# Altium schematic sheet ФЭУ.SchDoc: =GlobalProjectName
size 410 x 297 mm; ApprovedBy: Утвердил; CheckedBy: Проверил; Author: Разработал; DocumentNumber: XXX.XX.XX.XX.XXX Э3; SheetNumber: 2; SheetTotal: 2; PageSetup: Record=PageOptions|CenterHorizontal=True|CenterVertical=True|PrintScale=1.00|XCorrection=1.00|YCorrection=1.00|PrintKind=1|BorderSize=5000000|LeftOffset=0|BottomOffset=0|Orientation=2|PaperLength=1000|PaperWidth=1000|Scale=100|PaperSource=15|PrintQuality=1200|MediaType=1|DitherType=10|PaperKind=A3|PrintScaleMode=1; Weight: -; ScaleFactor: -; NormInspection: Норм.Контр.; FirstApplication: XXX.XX.XX.XX.XXX; GlobalProjectNumber: XXX.XX.XX.XX.XXX
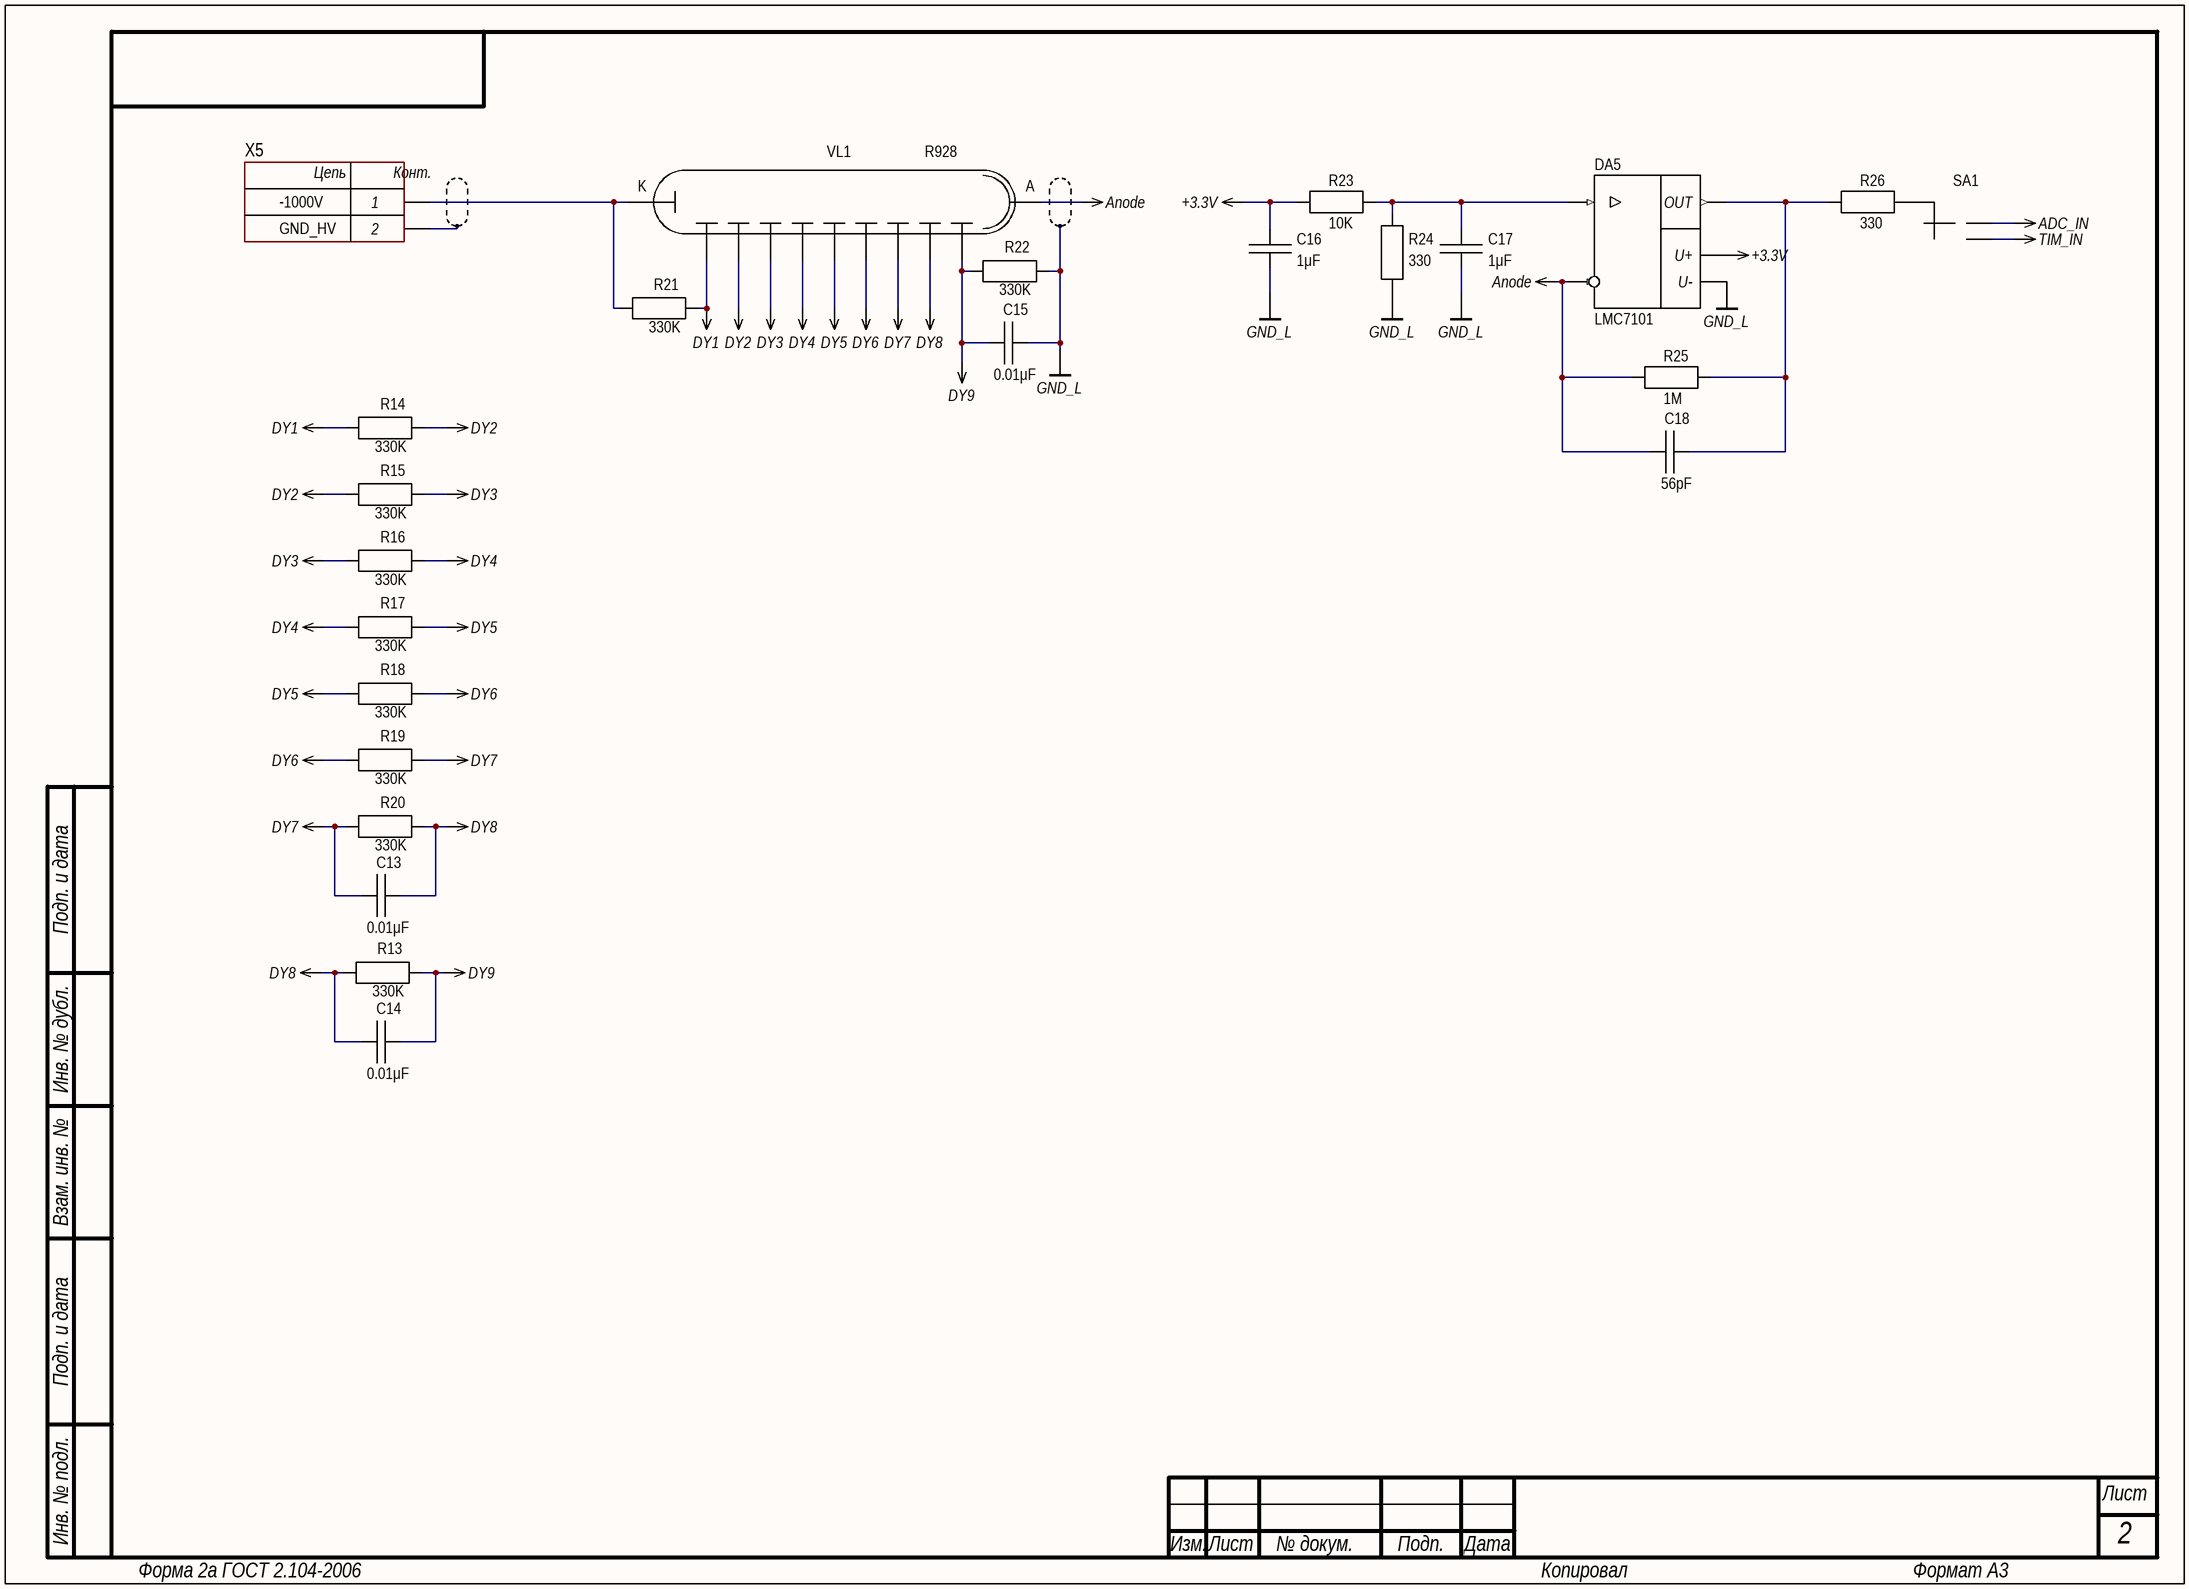
[diagram p0: ФЭУ.SchDoc]

## Parts
C13  value 0.01μF  [CAPASITOR 1206]
C14  value 0.01μF  [CAPASITOR 1206]
C15  value 0.01μF  [CAPASITOR 1206]
C16  value 1μF  [CAPASITOR 1206]
C17  value 1μF  [CAPASITOR 1206]
C18  value 56pF  [CAPASITOR 1206]
DA5  Операционный усилитель  (value not drawn)
R13  value 330K  [RESISTOR 1206]
R14  value 330K  [RESISTOR 1206]
R15  value 330K  [RESISTOR 1206]
R16  value 330K  [RESISTOR 1206]
R17  value 330K  [RESISTOR 1206]
R18  value 330K  [RESISTOR 1206]
R19  value 330K  [RESISTOR 1206]
R20  value 330K  [RESISTOR 1206]
R21  value 330K  [RESISTOR 1206]
R22  value 330K  [RESISTOR 1206]
R23  value 10K  [RESISTOR 1206]
R24  value 330  [RESISTOR 1206]
R25  value 1M  [RESISTOR 1206]
R26  value 330  [RESISTOR 1206]
SA1  Двухпозиционный переключатель  (value not drawn)
VL1  ФЭУ  (value not drawn)
X5  (no value)  [CON: 6PCV-03-006]

## Nets
+3.3V: C16.1 DA5.4(U+) R23.1
ADC_IN: SA1.1
Anode: C18.1 DA5.3 R25.2 VL1.11
DY1: R14.2 R21.1 VL1.2
DY2: R14.1 R15.2 VL1.3
DY3: R15.1 R16.2 VL1.4
DY4: R16.1 R17.2 VL1.5
DY5: R17.1 R18.2 VL1.6
DY6: R18.1 R19.2 VL1.7
DY7: C13.2 R19.1 R20.2 VL1.8
DY8: C13.1 C14.2 R13.2 R20.1 VL1.9
DY9: C14.1 C15.2 R13.1 R22.2 VL1.10
GND_L: C15.1 C16.2 C17.2 DA5.5(U-) R22.1 R24.2
TIM_IN: SA1.2
NetC17_1: C17.1 DA5.2 R23.2 R24.1
NetC18_2: C18.2 DA5.1(OUT) R25.1 R26.2
NetR21_2: R21.2 VL1.1 X5.1
NetR26_1: R26.1 SA1.A

Not connected (* = marked no-connect by the designer): X5 2

## Notes on the sheet
- (near VL1) R928
- -1000V
- GND_HV
- (near DA5) LMC7101
- Подп. и дата
- Инв. № дубл.
- Взам. инв. №
- Инв. № подл.
- Изм.
- Лист
- № докум.
- Подп.
- Дата
- Форма 2а ГОСТ 2.104-2006
- Копировал
- Формат А3
- (in symbol CONNECTOR 2 PIN) Цепь; Конт.
- (in symbol ФЭУ) K; A

## Library data of the parts
C13-C15 = CAPASITOR: Manufacturer: Yageo; PartNumber: CC1206KRX7R9BB104; ValueManufacturerPartNumber: Ceramic capacitor, 0.01μF, X7R, ±10%, 25V, 1206, -55...+125°C; TypeCapacitor: Ceramic capacitor; Tolerance: ±10%; TypeDielectric: X7R; Voltage: 25V; Package: 1206; HelpURL: https://www.digikey.com/product-detail/en/yageo/CC1206KRX7R9BB104/311-1179-1-ND/303089; Temperature: -55...+125°C
C16 C17 = CAPASITOR: Manufacturer: Yageo; PartNumber: CC1206KRX7R9BB104; ValueManufacturerPartNumber: Ceramic capacitor, 1μF, X7R, ±10%, 25V, 1206, -55...+125°C; TypeCapacitor: Ceramic capacitor; Tolerance: ±10%; TypeDielectric: X7R; Voltage: 25V; Package: 1206; HelpURL: https://www.digikey.com/product-detail/en/yageo/CC1206KRX7R9BB104/311-1179-1-ND/303089; Temperature: -55...+125°C
C18 = CAPASITOR: Manufacturer: Yageo; PartNumber: CC1206KRX7R9BB104; ValueManufacturerPartNumber: Ceramic capacitor, 56pF, X7R, ±10%, 25V, 1206, -55...+125°C; TypeCapacitor: Ceramic capacitor; Tolerance: ±10%; TypeDielectric: X7R; Voltage: 25V; Package: 1206; HelpURL: https://www.digikey.com/product-detail/en/yageo/CC1206KRX7R9BB104/311-1179-1-ND/303089; Temperature: -55...+125°C
R13-R22 = RESISTOR: Manufacturer: Yageo; PartNumber: RC1206JR-07100RL; ValueManufacturerPartNumber: Resistor film, 330K, ±5%, 1206, 0.25W, -55...+125°C; TypeResistor: Resistor film; Power: 0.25W; Tolerance: ±5%; Package: 1206; HelpURL: https://www.digikey.com/product-detail/en/yageo/RC1206JR-07100RL/311-100ERCT-ND/732153; Temperature: -55...+125°C
R23 = RESISTOR: Manufacturer: Yageo; PartNumber: RC1206JR-07100RL; ValueManufacturerPartNumber: Resistor film, 10K, ±5%, 1206, 0.25W, -55...+125°C; TypeResistor: Resistor film; Power: 0.25W; Tolerance: ±5%; Package: 1206; HelpURL: https://www.digikey.com/product-detail/en/yageo/RC1206JR-07100RL/311-100ERCT-ND/732153; Temperature: -55...+125°C
R24 R26 = RESISTOR: Manufacturer: Yageo; PartNumber: RC1206JR-07100RL; ValueManufacturerPartNumber: Resistor film, 330, ±5%, 1206, 0.25W, -55...+125°C; TypeResistor: Resistor film; Power: 0.25W; Tolerance: ±5%; Package: 1206; HelpURL: https://www.digikey.com/product-detail/en/yageo/RC1206JR-07100RL/311-100ERCT-ND/732153; Temperature: -55...+125°C
R25 = RESISTOR: Manufacturer: Yageo; PartNumber: RC1206JR-07100RL; ValueManufacturerPartNumber: Resistor film, 1M, ±5%, 1206, 0.25W, -55...+125°C; TypeResistor: Resistor film; Power: 0.25W; Tolerance: ±5%; Package: 1206; HelpURL: https://www.digikey.com/product-detail/en/yageo/RC1206JR-07100RL/311-100ERCT-ND/732153; Temperature: -55...+125°C
X5 = CONNECTOR 2 PIN: Manufacturer: Degson; ValueManufacturerPartNumber: Terminal connector, 2pin, 3.5mm, 300VAC, 10A; PartNumber: DG350-3.5-02P-14; TypeConnector: Terminal connector; VoltageMax: 300VAC; Pitch: 3.5mm; CurrentMax: 10A; Multichannel: 2pin; CommentText: "Разъем"; HelpURL: https://www.chipdip.ru/product/dg350-3.5-02p-12